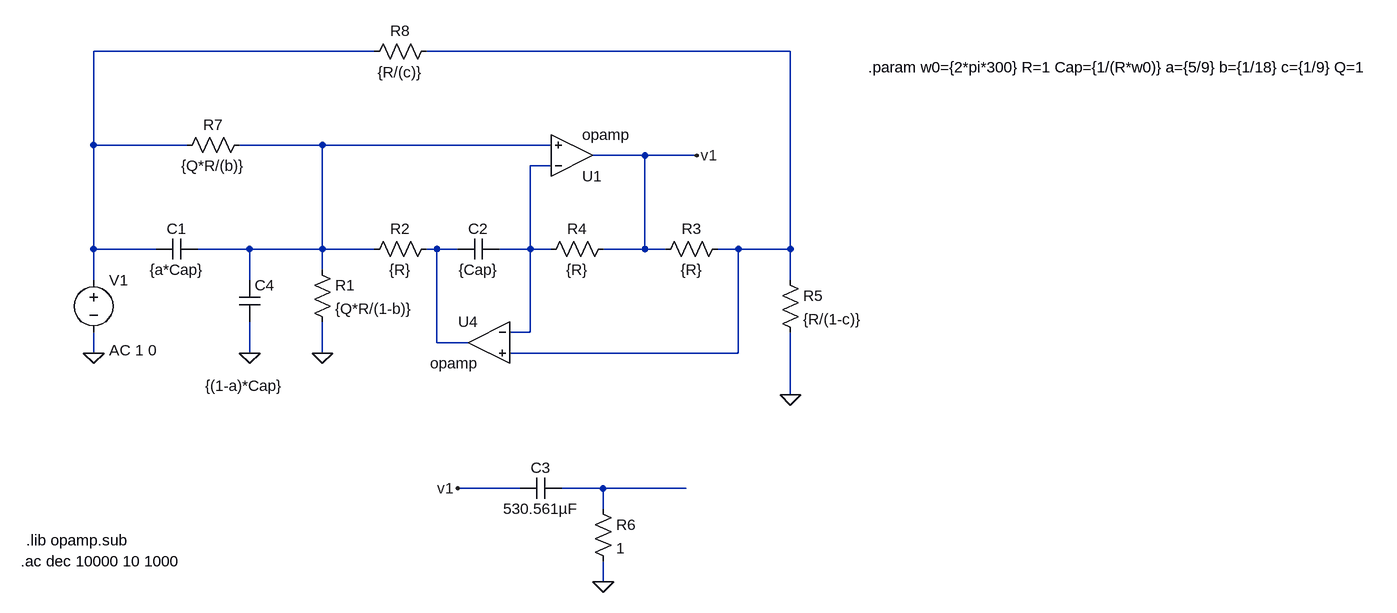
[diagram p0: schematic schaumann.asc]
schaumann.asc, the LTspice schematic file:
Version 4
SHEET 1 2112 1108
WIRE 400 -224 -32 -224
WIRE 1040 -224 480 -224
WIRE -32 -80 -32 -224
WIRE 112 -80 -32 -80
WIRE 320 -80 192 -80
WIRE 672 -80 320 -80
WIRE 816 -64 736 -64
WIRE 896 -64 816 -64
WIRE 672 -48 640 -48
WIRE -32 80 -32 -80
WIRE 64 80 -32 80
WIRE 208 80 128 80
WIRE 320 80 320 -80
WIRE 320 80 208 80
WIRE 400 80 320 80
WIRE 496 80 480 80
WIRE 528 80 496 80
WIRE 640 80 640 -48
WIRE 640 80 592 80
WIRE 672 80 640 80
WIRE 816 80 816 -64
WIRE 816 80 752 80
WIRE 848 80 816 80
WIRE 960 80 928 80
WIRE 1040 80 1040 -224
WIRE 1040 80 960 80
WIRE 320 112 320 80
WIRE -32 128 -32 80
WIRE 208 128 208 80
WIRE 1040 128 1040 80
WIRE 640 208 640 80
WIRE 640 208 608 208
WIRE 496 224 496 80
WIRE 544 224 496 224
WIRE -32 240 -32 208
WIRE 208 240 208 192
WIRE 320 240 320 192
WIRE 960 240 960 80
WIRE 960 240 608 240
WIRE 1040 304 1040 208
WIRE 624 448 528 448
WIRE 752 448 688 448
WIRE 880 448 752 448
WIRE 752 480 752 448
WIRE 752 592 752 560
FLAG -32 240 0
FLAG 320 240 0
FLAG 752 592 0
FLAG 1040 304 0
FLAG 208 240 0
FLAG 896 -64 v1
FLAG 528 448 v1
SYMBOL res 496 64 R90
WINDOW 0 0 56 VBottom 2
WINDOW 3 32 56 VTop 2
SYMATTR InstName R2
SYMATTR Value {R}
SYMBOL res 768 64 R90
WINDOW 0 0 56 VBottom 2
WINDOW 3 32 56 VTop 2
SYMATTR InstName R4
SYMATTR Value {R}
SYMBOL OpAmps\\opamp 704 0 M180
SYMATTR InstName U1
SYMBOL OpAmps\\opamp 576 160 M0
SYMATTR InstName U4
SYMBOL res 1024 112 R0
SYMATTR InstName R5
SYMATTR Value {R/(1-c)}
SYMBOL voltage -32 112 R0
WINDOW 123 24 124 Left 2
WINDOW 39 0 0 Left 0
SYMATTR Value2 AC 1 0
SYMATTR InstName V1
SYMATTR Value ""
SYMBOL cap 128 64 R90
WINDOW 0 0 32 VBottom 2
WINDOW 3 32 32 VTop 2
SYMATTR InstName C1
SYMATTR Value {a*Cap}
SYMBOL res 304 96 R0
SYMATTR InstName R1
SYMATTR Value {Q*R/(1-b)}
SYMBOL res 736 464 R0
SYMATTR InstName R6
SYMATTR Value 1
SYMBOL cap 688 432 R90
WINDOW 0 0 32 VBottom 2
WINDOW 3 32 32 VTop 2
SYMATTR InstName C3
SYMATTR Value 530.561µF
SYMBOL res 944 64 R90
WINDOW 0 0 56 VBottom 2
WINDOW 3 32 56 VTop 2
SYMATTR InstName R3
SYMATTR Value {R}
SYMBOL cap 592 64 R90
WINDOW 0 0 32 VBottom 2
WINDOW 3 32 32 VTop 2
SYMATTR InstName C2
SYMATTR Value {Cap}
SYMBOL res 208 -96 R90
WINDOW 0 0 56 VBottom 2
WINDOW 3 32 56 VTop 2
SYMATTR InstName R7
SYMATTR Value {Q*R/(b)}
SYMBOL cap 192 128 R0
WINDOW 3 -52 162 Left 2
SYMATTR InstName C4
SYMATTR Value {(1-a)*Cap}
SYMBOL res 496 -240 R90
WINDOW 0 0 56 VBottom 2
WINDOW 3 32 56 VTop 2
SYMATTR InstName R8
SYMATTR Value {R/(c)}
TEXT -144 560 Left 2 !.ac dec 10000 10 1000
TEXT -136 528 Left 2 !.lib opamp.sub
TEXT 1160 -200 Left 2 !.param w0={2*pi*300} R=1 Cap={1/(R*w0)} a={5/9} b={1/18} c={1/9} Q=1

The netlist it stands for:
* schaumann.asc
R2 N005 N003 {R}
R4 v1 N004 {R}
XU1 N004 N003 v1 opamp Aol=100K GBW=10Meg  ; pins invin noninvin out
XU4 N004 N002 N005 opamp Aol=100K GBW=10Meg  ; pins invin noninvin out
R5 N002 0 {R/(1-c)}
V1 N001 0 AC 1 0
C1 N003 N001 {a*Cap}
R1 N003 0 {Q*R/(1-b)}
R6 N006 0 1
C3 N006 v1 530.561µF
R3 N002 v1 {R}
C2 N004 N005 {Cap}
R7 N003 N001 {Q*R/(b)}
C4 N003 0 {(1-a)*Cap}
R8 N002 N001 {R/(c)}
.ac dec 10000 10 1000
.lib opamp.sub
.param w0={2*pi*300} R=1 Cap={1/(R*w0)} a={5/9} b={1/18} c={1/9} Q=1
.backanno
.end